# Altium schematic sheet High Level.SchDoc
size A2
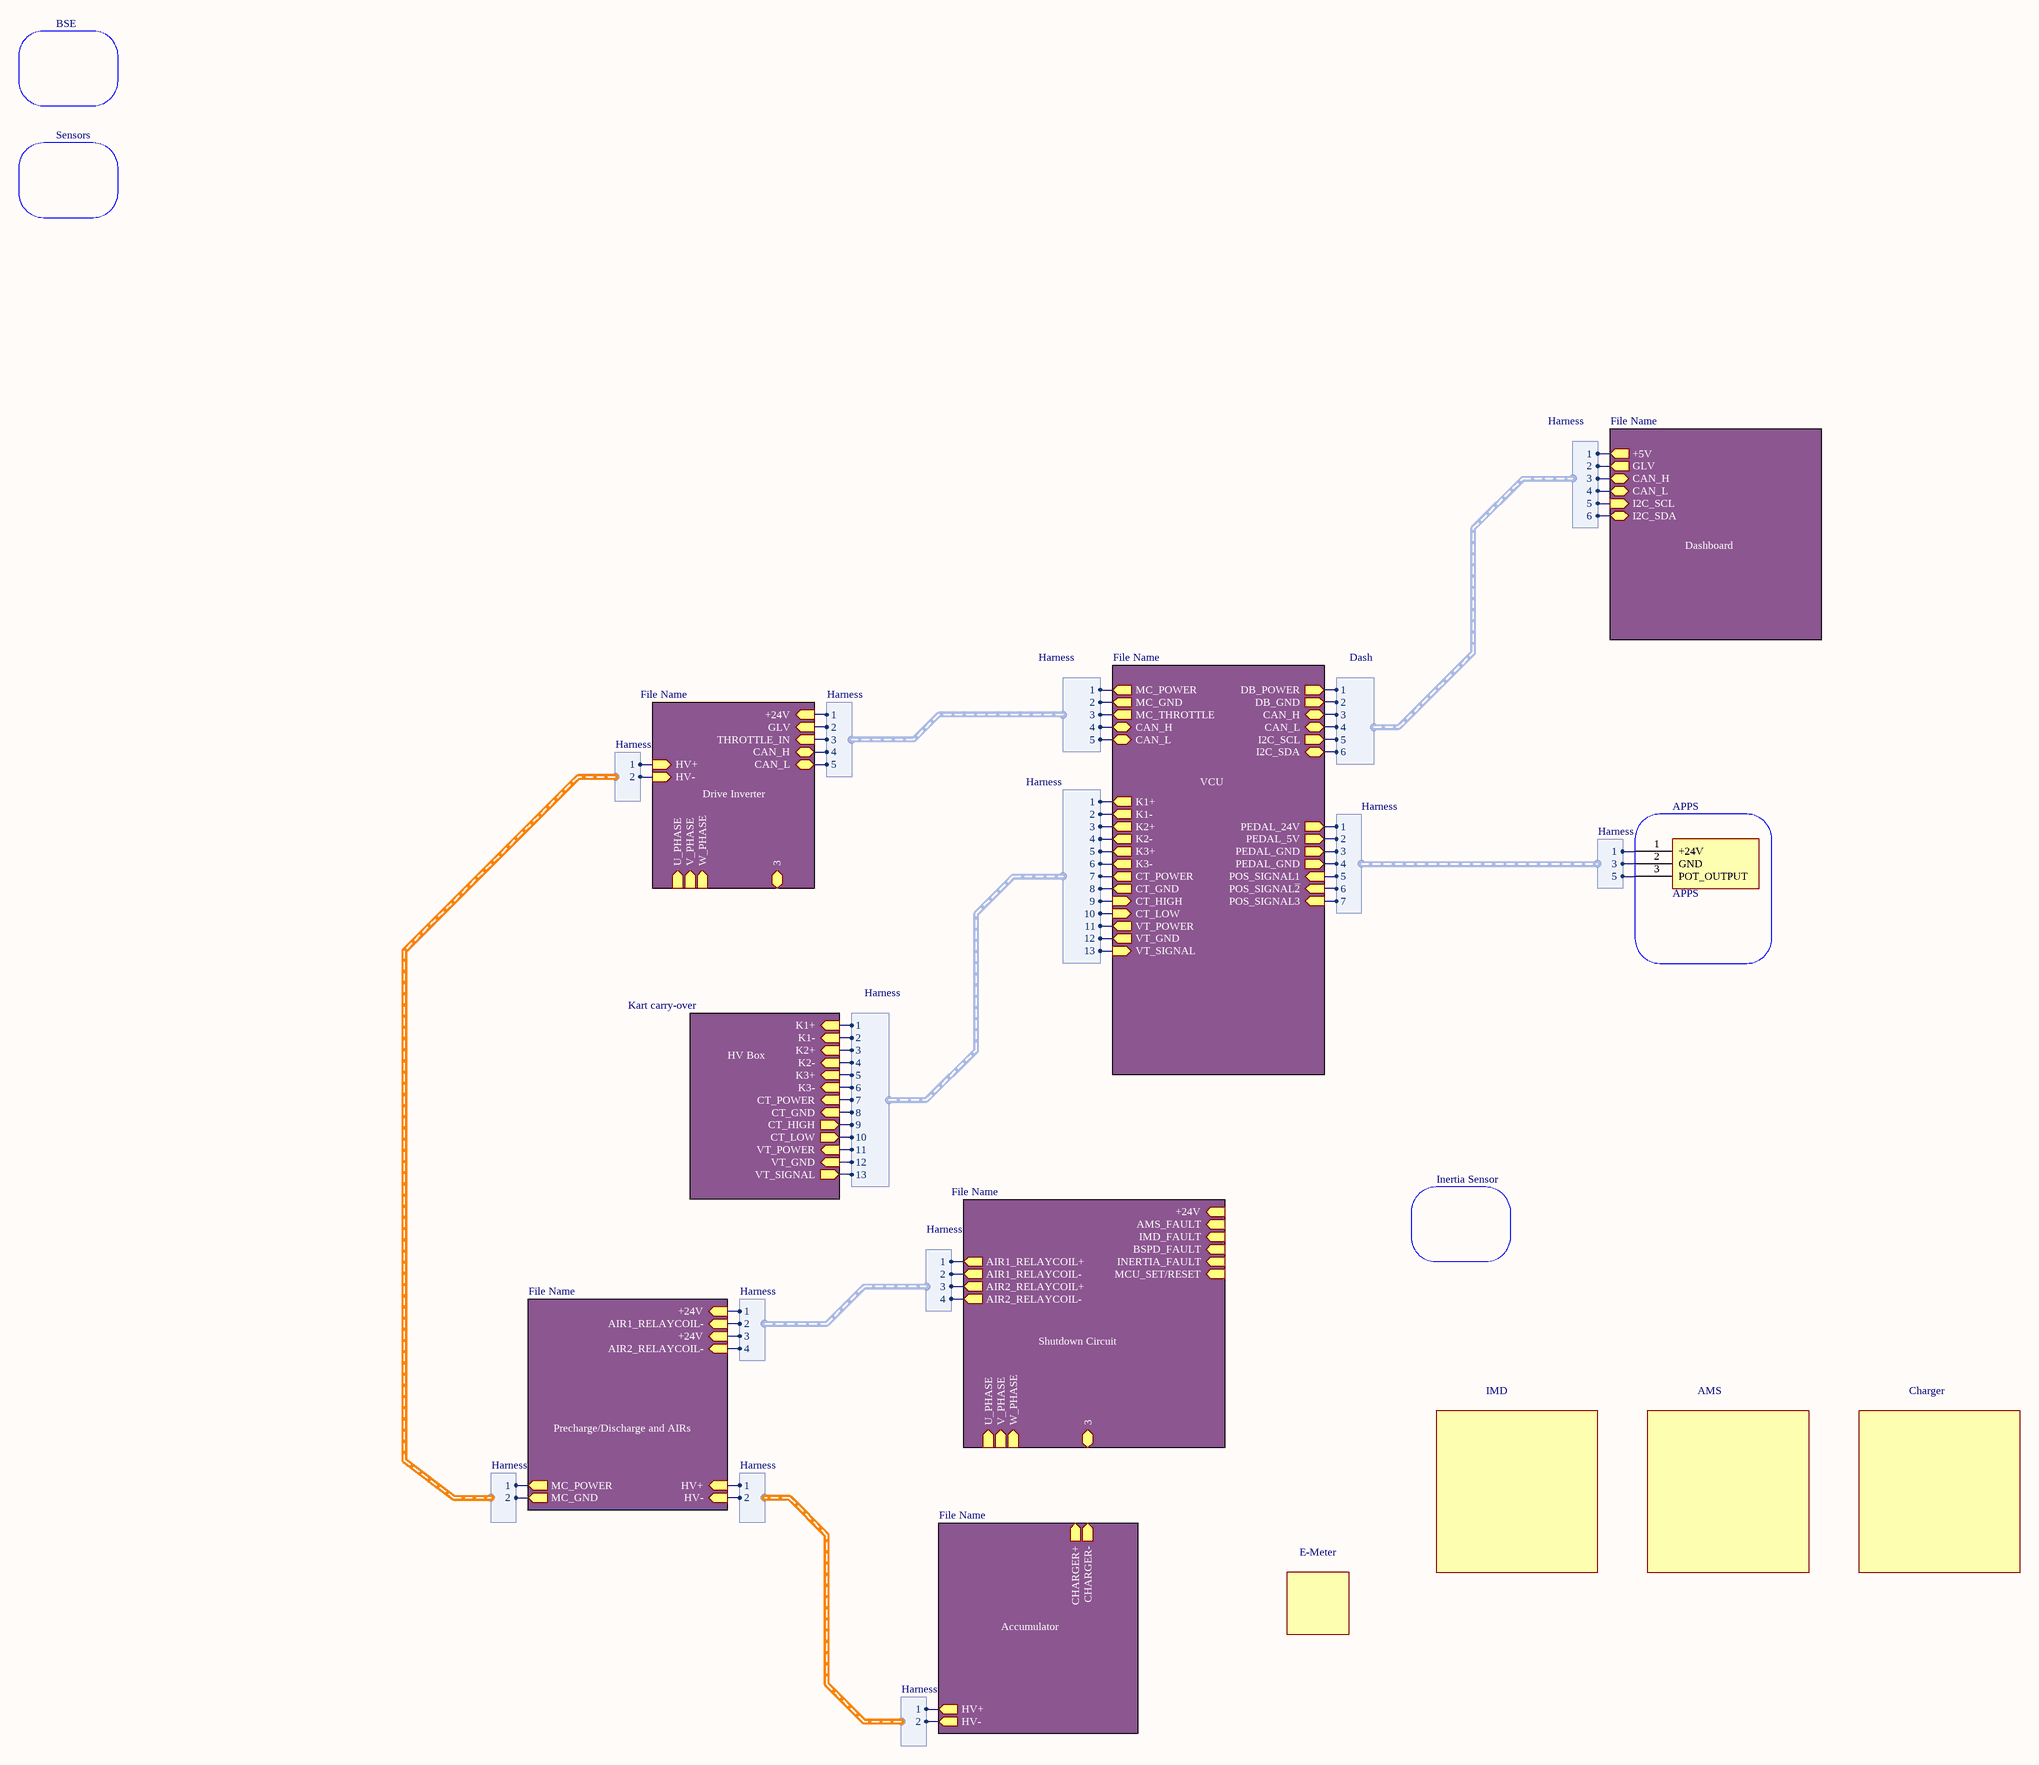
[diagram p0: High Level.SchDoc]

## Parts
APPS  APPS  (value not drawn)

## Blocks framed on the sheet
APPS: APPS

## Sub-sheets
Accumulator = File Name: HV+, HV-, CHARGER+, CHARGER-
Dashboard = File Name: +5V, GLV, CAN_H, CAN_L, I2C_SCL, I2C_SDA
Drive Inverter = File Name: +24V, GLV, THROTTLE_IN, 3, U_PHASE, V_PHASE, W_PHASE, HV-, HV+, CAN_H, CAN_L
HV Box = Kart carry-over: K1+, K1-, K2+, K2-, K3+, K3-, CT_POWER, CT_GND, CT_HIGH, CT_LOW, VT_POWER, VT_GND, VT_SIGNAL
Precharge/Discharge and AIRs = File Name: MC_POWER, MC_GND, HV+, HV-, +24V, AIR1_RELAYCOIL-, +24V, AIR2_RELAYCOIL-
Shutdown Circuit = File Name: +24V, AMS_FAULT, IMD_FAULT, 3, U_PHASE, V_PHASE, W_PHASE, BSPD_FAULT, INERTIA_FAULT, AIR1_RELAYCOIL+, AIR1_RELAYCOIL-, AIR2_RELAYCOIL+, AIR2_RELAYCOIL-, MCU_SET/RESET
VCU = File Name: MC_POWER, MC_GND, MC_THROTTLE, CAN_H, CAN_L, DB_POWER, DB_GND, CAN_H, CAN_L, I2C_SCL, I2C_SDA, K1+, K1-, K2+, K2-, K3+, K3-, CT_POWER, CT_GND, CT_HIGH, CT_LOW, VT_POWER, VT_GND, VT_SIGNAL, PEDAL_24V, PEDAL_5V, PEDAL_GND, PEDAL_GND, POS_SIGNAL1, POS_SIGNAL~{2}, POS_SIGNAL3

## Harnesses
Harness: 1, 2, 3, 4, 5
Harness: 1, 2
Harness: 1, 2, 3, 4, 5, 6
Dash: 1, 2, 3, 4, 5, 6
Harness: 1, 2, 3, 4, 5, 6, 7, 8, 9, 10, 11, 12, 13
Harness: 1, 2, 3, 4, 5, 6, 7
Harness: 1, 3, 5
Harness: 1, 2, 3, 4

## Nets
NetAPPS_1: APPS.1(+24V) ; sheet VCU/PEDAL_24V, harness Harness.1
NetAPPS_2: APPS.2(GND) ; sheet VCU/PEDAL_GND, harness Harness.3
NetAPPS_3: APPS.3(POT_OUTPUT) ; sheet VCU/POS_SIGNAL1, harness Harness.5
(unnamed): sheet VCU/MC_POWER, sheet Drive Inverter/+24V, harness Harness.1
(unnamed): sheet VCU/MC_GND, sheet Drive Inverter/GLV, harness Harness.2
(unnamed): sheet VCU/MC_THROTTLE, sheet Drive Inverter/THROTTLE_IN, harness Harness.3
(unnamed): sheet VCU/CAN_H, sheet Drive Inverter/CAN_H, harness Harness.4
(unnamed): sheet VCU/CAN_L, sheet Drive Inverter/CAN_L, harness Harness.5
(unnamed): sheet VCU/DB_POWER, sheet Dashboard/+5V, harness Harness.1, harness Dash.1
(unnamed): sheet VCU/DB_GND, sheet Dashboard/GLV, harness Harness.2, harness Dash.2
(unnamed): sheet VCU/CAN_H, sheet Dashboard/CAN_H, harness Harness.3, harness Dash.3
(unnamed): sheet VCU/CAN_L, sheet Dashboard/CAN_L, harness Harness.4, harness Dash.4
(unnamed): sheet VCU/I2C_SCL, sheet Dashboard/I2C_SCL, harness Harness.5, harness Dash.5
(unnamed): sheet VCU/I2C_SDA, sheet Dashboard/I2C_SDA, harness Harness.6, harness Dash.6
(unnamed): sheet VCU/K1+, sheet HV Box/K1+, harness Harness.1
(unnamed): sheet VCU/K1-, sheet HV Box/K1-, harness Harness.2
(unnamed): sheet VCU/K2+, sheet HV Box/K2+, harness Harness.3
(unnamed): sheet VCU/K2-, sheet HV Box/K2-, harness Harness.4
(unnamed): sheet VCU/K3+, sheet HV Box/K3+, harness Harness.5
(unnamed): sheet VCU/K3-, sheet HV Box/K3-, harness Harness.6
(unnamed): sheet VCU/CT_POWER, sheet HV Box/CT_POWER, harness Harness.7
(unnamed): sheet VCU/CT_GND, sheet HV Box/CT_GND, harness Harness.8
(unnamed): sheet VCU/CT_HIGH, sheet HV Box/CT_HIGH, harness Harness.9
(unnamed): sheet VCU/CT_LOW, sheet HV Box/CT_LOW, harness Harness.10
(unnamed): sheet VCU/VT_POWER, sheet HV Box/VT_POWER, harness Harness.11
(unnamed): sheet VCU/VT_GND, sheet HV Box/VT_GND, harness Harness.12
(unnamed): sheet VCU/VT_SIGNAL, sheet HV Box/VT_SIGNAL, harness Harness.13
(unnamed): sheet VCU/PEDAL_5V, harness Harness.2
(unnamed): sheet VCU/PEDAL_GND, harness Harness.4
(unnamed): sheet VCU/POS_SIGNAL~{2}, harness Harness.6
(unnamed): sheet VCU/POS_SIGNAL3, harness Harness.7
(unnamed): sheet Drive Inverter/HV-, sheet Precharge/Discharge and AIRs/MC_GND, harness Harness.2
(unnamed): sheet Drive Inverter/HV+, sheet Precharge/Discharge and AIRs/MC_POWER, harness Harness.1
(unnamed): sheet Precharge/Discharge and AIRs/HV+, sheet Accumulator/HV+, harness Harness.1
(unnamed): sheet Precharge/Discharge and AIRs/HV-, sheet Accumulator/HV-, harness Harness.2
(unnamed): sheet Precharge/Discharge and AIRs/+24V, sheet Shutdown Circuit/AIR1_RELAYCOIL+, harness Harness.1
(unnamed): sheet Precharge/Discharge and AIRs/AIR1_RELAYCOIL-, sheet Shutdown Circuit/AIR1_RELAYCOIL-, harness Harness.2
(unnamed): sheet Precharge/Discharge and AIRs/+24V, sheet Shutdown Circuit/AIR2_RELAYCOIL+, harness Harness.3
(unnamed): sheet Precharge/Discharge and AIRs/AIR2_RELAYCOIL-, sheet Shutdown Circuit/AIR2_RELAYCOIL-, harness Harness.4

## Notes on the sheet
- BSE
- Sensors
- Inertia Sensor
- IMD
- AMS
- Charger
- E-Meter

## Library data of the parts
APPS = APPS: Accelerator Position Pedal System